# Altium schematic sheet HDMI_OUT.SchDoc
size A; SheetNumber: 6; SheetTotal: 10
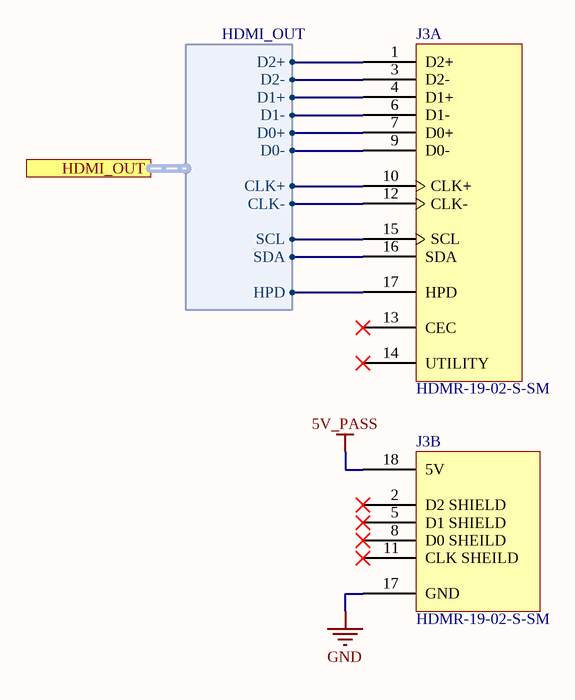
[diagram p0: HDMI_OUT.SchDoc]

## Parts
J3  HDMR-19-02-S-SM  [SAMTEC_HDMR-19-02-S-SM]  (parts A,B of 2)

## Ports
HDMI_OUT (harness HDMI_OUT, see HDMI[3B], HDMI_SWITCH[3B])

## Harnesses
HDMI_OUT: SCL, SDA, HPD, D0+, D0-, D1+, D1-, D2+, D2-, CLK+, CLK-

## Nets
5V_PASS: J3.18(5V)
GND: J3.17(GND)
NetJ3_1: J3.1(D2+) ; port HDMI_OUT.D2+
NetJ3_3: J3.3(D2-) ; port HDMI_OUT.D2-
NetJ3_4: J3.4(D1+) ; port HDMI_OUT.D1+
NetJ3_6: J3.6(D1-) ; port HDMI_OUT.D1-
NetJ3_7: J3.7(D0+) ; port HDMI_OUT.D0+
NetJ3_9: J3.9(D0-) ; port HDMI_OUT.D0-
NetJ3_10: J3.10(CLK+) ; port HDMI_OUT.CLK+
NetJ3_12: J3.12(CLK-) ; port HDMI_OUT.CLK-
NetJ3_15: J3.15(SCL) ; port HDMI_OUT.SCL
NetJ3_16: J3.16(SDA) ; port HDMI_OUT.SDA
NetJ3_17: J3.17(HPD) ; port HDMI_OUT.HPD

Not connected (* = marked no-connect by the designer): J3 2(D2_SHIELD)* 5(D1_SHIELD)* 8(D0_SHEILD)* 11(CLK_SHEILD)* 13(CEC)* 14(UTILITY)*

## Library data of the parts
J3 = SAMTEC_HDMR-19-02-S-SM: Conn HDMI RCP 19 POS 0.5mm Solder RA SMD 19 Terminal 1 Port